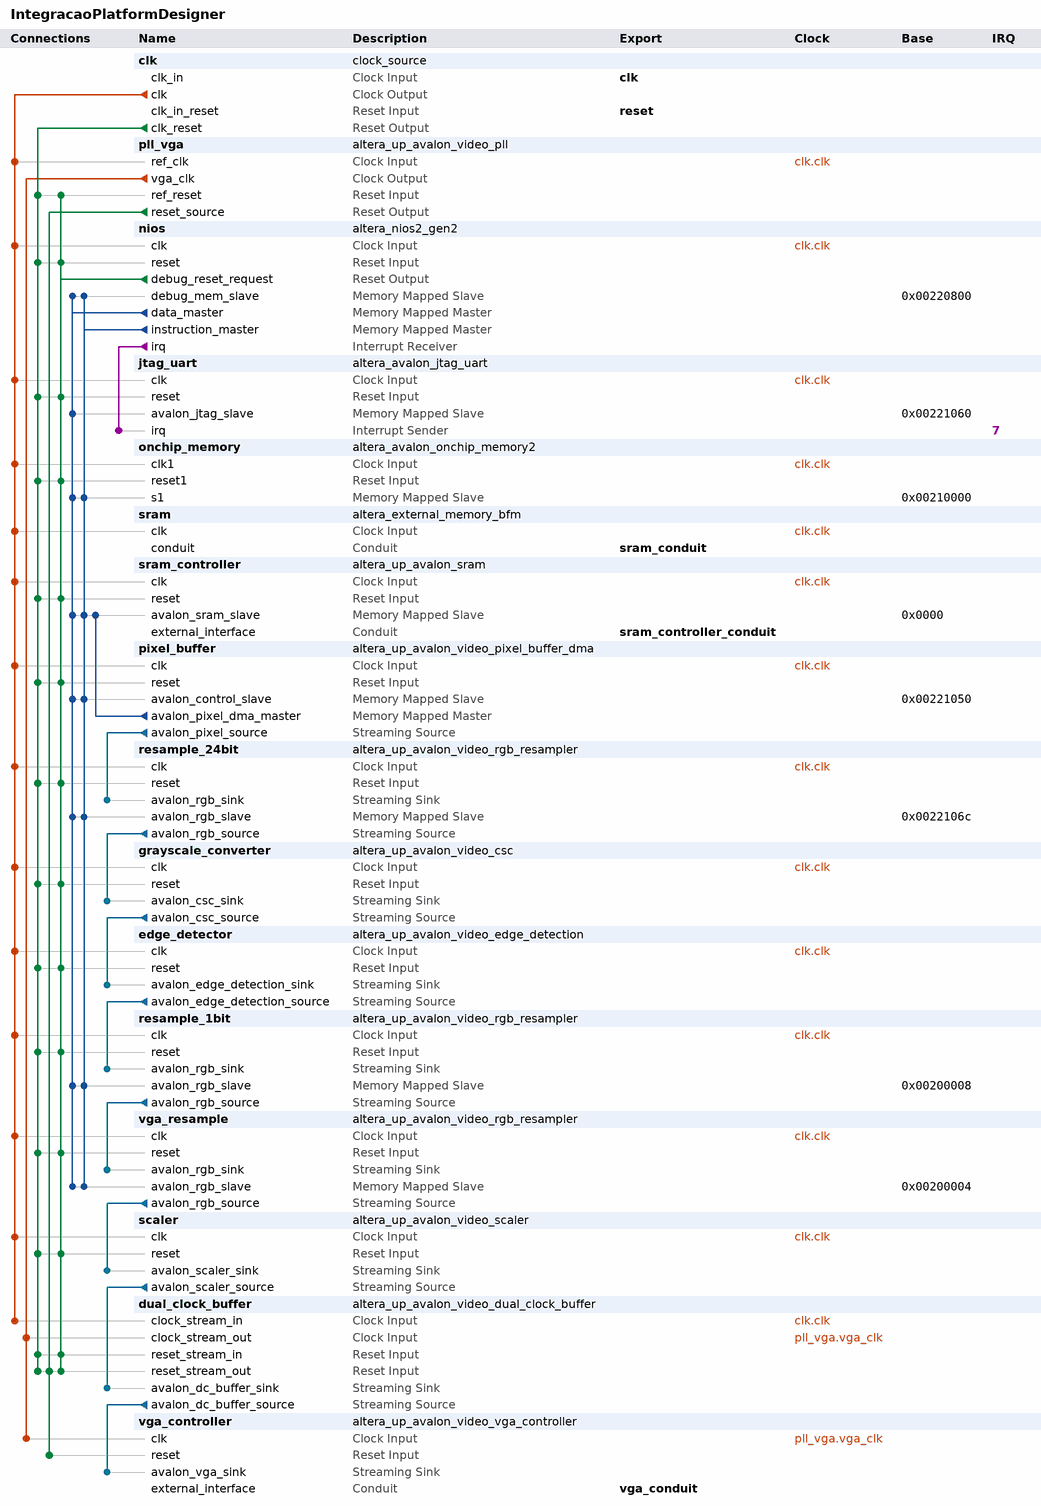
[diagram p0: system contents]
# Platform Designer (Qsys) system IntegracaoPlatformDesigner, Cyclone IV E EP4CE115F29C7
# Parameters at their usual value, and those the tool derives, are not listed.
package require -exact qsys 18.0
create_system IntegracaoPlatformDesigner
set_project_property DEVICE_FAMILY {Cyclone IV E}
set_project_property DEVICE EP4CE115F29C7

add_instance clk clock_source 20.1
set_instance_parameter_value clk clockFrequency 50000000

add_instance pll_vga altera_up_avalon_video_pll 18.0
set_instance_parameter_value pll_vga camera {5MP Digital Camera (THDB_D5M)}
set_instance_parameter_value pll_vga gui_refclk 50.0
set_instance_parameter_value pll_vga lcd {7" LCD on VEEK-MT and MTL/MTL2 Modules}

add_instance nios altera_nios2_gen2 20.1
set_instance_parameter_value nios dcache_size 2048
set_instance_parameter_value nios exceptionSlave onchip_memory.s1
set_instance_parameter_value nios icache_size 4096
set_instance_parameter_value nios impl Tiny
set_instance_parameter_value nios resetSlave onchip_memory.s1

add_instance jtag_uart altera_avalon_jtag_uart 20.1
set_instance_parameter_value jtag_uart simInteractiveOptions NO_INTERACTIVE_WINDOWS
set_instance_parameter_value jtag_uart useRegistersForReadBuffer true
set_instance_parameter_value jtag_uart useRegistersForWriteBuffer true

add_instance onchip_memory altera_avalon_onchip_memory2 20.1
set_instance_parameter_value onchip_memory dataWidth 16
set_instance_parameter_value onchip_memory dualPort false
set_instance_parameter_value onchip_memory initMemContent true
set_instance_parameter_value onchip_memory initializationFileName onchip_mem.hex
set_instance_parameter_value onchip_memory memorySize 65536
set_instance_parameter_value onchip_memory singleClockOperation true

add_instance sram altera_external_memory_bfm 20.1
set_instance_parameter_value sram ACTIVE_LOW_BEGINTRANSFER 0
set_instance_parameter_value sram ACTIVE_LOW_BYTEENABLE 1
set_instance_parameter_value sram ACTIVE_LOW_CHIPSELECT 1
set_instance_parameter_value sram ACTIVE_LOW_OUTPUTENABLE 1
set_instance_parameter_value sram ACTIVE_LOW_READ 0
set_instance_parameter_value sram ACTIVE_LOW_RESET 0
set_instance_parameter_value sram ACTIVE_LOW_WRITE 1
set_instance_parameter_value sram CDT_ADDRESS_W 20
set_instance_parameter_value sram CDT_NUMSYMBOLS 2
set_instance_parameter_value sram CDT_READ_LATENCY 2
set_instance_parameter_value sram CDT_SYMBOL_W 8
set_instance_parameter_value sram INIT_FILE altera_external_memory_bfm.hex
set_instance_parameter_value sram SIGNAL_ADDRESS_ROLES cdt_address
set_instance_parameter_value sram SIGNAL_BEGINTRANSFER_ROLES cdt_begintransfer
set_instance_parameter_value sram SIGNAL_BYTEENABLE_ROLES cdt_byteenable
set_instance_parameter_value sram SIGNAL_CHIPSELECT_ROLES cdt_chipselect
set_instance_parameter_value sram SIGNAL_DATA_ROLES cdt_data_io
set_instance_parameter_value sram SIGNAL_OUTPUTENABLE_ROLES cdt_outputenable
set_instance_parameter_value sram SIGNAL_READ_ROLES cdt_read
set_instance_parameter_value sram SIGNAL_RESET_ROLES cdt_reset
set_instance_parameter_value sram SIGNAL_WRITE_ROLES cdt_write
set_instance_parameter_value sram USE_BEGINTRANSFER 0
set_instance_parameter_value sram USE_BYTEENABLE 1
set_instance_parameter_value sram USE_CHIPSELECT 1
set_instance_parameter_value sram USE_OUTPUTENABLE 1
set_instance_parameter_value sram USE_READ 0
set_instance_parameter_value sram USE_RESET 0
set_instance_parameter_value sram USE_WRITE 1
set_instance_parameter_value sram VHDL_ID 0

add_instance sram_controller altera_up_avalon_sram 18.0
set_instance_parameter_value sram_controller board DE2-115
set_instance_parameter_value sram_controller pixel_buffer true

add_instance pixel_buffer altera_up_avalon_video_pixel_buffer_dma 18.0
set_instance_parameter_value pixel_buffer addr_mode Consecutive
set_instance_parameter_value pixel_buffer back_start_address 0
set_instance_parameter_value pixel_buffer color_space {16-bit RGB}
set_instance_parameter_value pixel_buffer image_height 480
set_instance_parameter_value pixel_buffer image_width 1280
set_instance_parameter_value pixel_buffer start_address 0

add_instance resample_24bit altera_up_avalon_video_rgb_resampler 18.0
set_instance_parameter_value resample_24bit alpha 1023
set_instance_parameter_value resample_24bit input_type {16-bit RGB}
set_instance_parameter_value resample_24bit output_type {24-bit RGB}

add_instance grayscale_converter altera_up_avalon_video_csc 18.0
set_instance_parameter_value grayscale_converter csc_type {24-bit RGB to Grayscale (Y)}

add_instance edge_detector altera_up_avalon_video_edge_detection 18.0
set_instance_parameter_value edge_detector intensity 2
set_instance_parameter_value edge_detector width 1280

add_instance resample_1bit altera_up_avalon_video_rgb_resampler 18.0
set_instance_parameter_value resample_1bit alpha 1023
set_instance_parameter_value resample_1bit input_type {8-bit Grayscale}
set_instance_parameter_value resample_1bit output_type {1-bit Black/White}

add_instance vga_resample altera_up_avalon_video_rgb_resampler 18.0
set_instance_parameter_value vga_resample alpha 1023
set_instance_parameter_value vga_resample input_type {1-bit Black/White}
set_instance_parameter_value vga_resample output_type {30-bit RGB}

add_instance scaler altera_up_avalon_video_scaler 18.0
set_instance_parameter_value scaler color_bits 10
set_instance_parameter_value scaler color_planes 3
set_instance_parameter_value scaler height_in 480
set_instance_parameter_value scaler height_scaling 1
set_instance_parameter_value scaler width_in 640
set_instance_parameter_value scaler width_scaling 0.5

add_instance dual_clock_buffer altera_up_avalon_video_dual_clock_buffer 18.0
set_instance_parameter_value dual_clock_buffer color_bits 10

add_instance vga_controller altera_up_avalon_video_vga_controller 18.0
set_instance_parameter_value vga_controller board DE2-115
set_instance_parameter_value vga_controller resolution {VGA 640x480}

# connections
add_connection clk.clk dual_clock_buffer.clock_stream_in clock
add_connection clk.clk edge_detector.clk clock
add_connection clk.clk grayscale_converter.clk clock
add_connection clk.clk jtag_uart.clk clock
add_connection clk.clk nios.clk clock
add_connection clk.clk onchip_memory.clk1 clock
add_connection clk.clk pixel_buffer.clk clock
add_connection clk.clk pll_vga.ref_clk clock
add_connection clk.clk resample_1bit.clk clock
add_connection clk.clk resample_24bit.clk clock
add_connection clk.clk scaler.clk clock
add_connection clk.clk sram.clk clock
add_connection clk.clk sram_controller.clk clock
add_connection clk.clk vga_resample.clk clock
add_connection pll_vga.vga_clk dual_clock_buffer.clock_stream_out clock
add_connection pll_vga.vga_clk vga_controller.clk clock
add_connection clk.clk_reset dual_clock_buffer.reset_stream_in reset
add_connection clk.clk_reset dual_clock_buffer.reset_stream_out reset
add_connection clk.clk_reset edge_detector.reset reset
add_connection clk.clk_reset grayscale_converter.reset reset
add_connection clk.clk_reset jtag_uart.reset reset
add_connection clk.clk_reset nios.reset reset
add_connection clk.clk_reset onchip_memory.reset1 reset
add_connection clk.clk_reset pixel_buffer.reset reset
add_connection clk.clk_reset pll_vga.ref_reset reset
add_connection clk.clk_reset resample_1bit.reset reset
add_connection clk.clk_reset resample_24bit.reset reset
add_connection clk.clk_reset scaler.reset reset
add_connection clk.clk_reset sram_controller.reset reset
add_connection clk.clk_reset vga_resample.reset reset
add_connection nios.debug_reset_request dual_clock_buffer.reset_stream_in reset
add_connection nios.debug_reset_request dual_clock_buffer.reset_stream_out reset
add_connection nios.debug_reset_request edge_detector.reset reset
add_connection nios.debug_reset_request grayscale_converter.reset reset
add_connection nios.debug_reset_request jtag_uart.reset reset
add_connection nios.debug_reset_request nios.reset reset
add_connection nios.debug_reset_request onchip_memory.reset1 reset
add_connection nios.debug_reset_request pixel_buffer.reset reset
add_connection nios.debug_reset_request pll_vga.ref_reset reset
add_connection nios.debug_reset_request resample_1bit.reset reset
add_connection nios.debug_reset_request resample_24bit.reset reset
add_connection nios.debug_reset_request scaler.reset reset
add_connection nios.debug_reset_request sram_controller.reset reset
add_connection nios.debug_reset_request vga_resample.reset reset
add_connection pll_vga.reset_source dual_clock_buffer.reset_stream_out reset
add_connection pll_vga.reset_source vga_controller.reset reset
add_connection nios.data_master jtag_uart.avalon_jtag_slave avalon
set_connection_parameter_value nios.data_master/jtag_uart.avalon_jtag_slave baseAddress 0x00221060
add_connection nios.data_master nios.debug_mem_slave avalon
set_connection_parameter_value nios.data_master/nios.debug_mem_slave baseAddress 0x00220800
add_connection nios.data_master onchip_memory.s1 avalon
set_connection_parameter_value nios.data_master/onchip_memory.s1 baseAddress 0x00210000
add_connection nios.data_master pixel_buffer.avalon_control_slave avalon
set_connection_parameter_value nios.data_master/pixel_buffer.avalon_control_slave baseAddress 0x00221050
add_connection nios.data_master resample_1bit.avalon_rgb_slave avalon
set_connection_parameter_value nios.data_master/resample_1bit.avalon_rgb_slave baseAddress 0x00200008
add_connection nios.data_master resample_24bit.avalon_rgb_slave avalon
set_connection_parameter_value nios.data_master/resample_24bit.avalon_rgb_slave baseAddress 0x0022106c
add_connection nios.data_master sram_controller.avalon_sram_slave avalon
set_connection_parameter_value nios.data_master/sram_controller.avalon_sram_slave baseAddress 0x0000
add_connection nios.data_master vga_resample.avalon_rgb_slave avalon
set_connection_parameter_value nios.data_master/vga_resample.avalon_rgb_slave baseAddress 0x00200004
add_connection nios.instruction_master nios.debug_mem_slave avalon
set_connection_parameter_value nios.instruction_master/nios.debug_mem_slave baseAddress 0x00220800
add_connection nios.instruction_master onchip_memory.s1 avalon
set_connection_parameter_value nios.instruction_master/onchip_memory.s1 baseAddress 0x00210000
add_connection nios.instruction_master pixel_buffer.avalon_control_slave avalon
set_connection_parameter_value nios.instruction_master/pixel_buffer.avalon_control_slave baseAddress 0x00221050
add_connection nios.instruction_master resample_1bit.avalon_rgb_slave avalon
set_connection_parameter_value nios.instruction_master/resample_1bit.avalon_rgb_slave baseAddress 0x00200008
add_connection nios.instruction_master resample_24bit.avalon_rgb_slave avalon
set_connection_parameter_value nios.instruction_master/resample_24bit.avalon_rgb_slave baseAddress 0x0022106c
add_connection nios.instruction_master sram_controller.avalon_sram_slave avalon
set_connection_parameter_value nios.instruction_master/sram_controller.avalon_sram_slave baseAddress 0x0000
add_connection nios.instruction_master vga_resample.avalon_rgb_slave avalon
set_connection_parameter_value nios.instruction_master/vga_resample.avalon_rgb_slave baseAddress 0x00200004
add_connection pixel_buffer.avalon_pixel_dma_master sram_controller.avalon_sram_slave avalon
set_connection_parameter_value pixel_buffer.avalon_pixel_dma_master/sram_controller.avalon_sram_slave baseAddress 0x0000
add_connection dual_clock_buffer.avalon_dc_buffer_source vga_controller.avalon_vga_sink avalon_streaming
add_connection edge_detector.avalon_edge_detection_source resample_1bit.avalon_rgb_sink avalon_streaming
add_connection grayscale_converter.avalon_csc_source edge_detector.avalon_edge_detection_sink avalon_streaming
add_connection pixel_buffer.avalon_pixel_source resample_24bit.avalon_rgb_sink avalon_streaming
add_connection resample_1bit.avalon_rgb_source vga_resample.avalon_rgb_sink avalon_streaming
add_connection resample_24bit.avalon_rgb_source grayscale_converter.avalon_csc_sink avalon_streaming
add_connection scaler.avalon_scaler_source dual_clock_buffer.avalon_dc_buffer_sink avalon_streaming
add_connection vga_resample.avalon_rgb_source scaler.avalon_scaler_sink avalon_streaming
add_connection nios.irq jtag_uart.irq interrupt
set_connection_parameter_value nios.irq/jtag_uart.irq irqNumber 7

# exported interfaces
add_interface clk clock sink
set_interface_property clk EXPORT_OF clk.clk_in
add_interface reset reset sink
set_interface_property reset EXPORT_OF clk.clk_in_reset
add_interface sram_conduit conduit end
set_interface_property sram_conduit EXPORT_OF sram.conduit
add_interface sram_controller_conduit conduit end
set_interface_property sram_controller_conduit EXPORT_OF sram_controller.external_interface
add_interface vga_conduit conduit end
set_interface_property vga_conduit EXPORT_OF vga_controller.external_interface

set_interconnect_requirement {$system} qsys_mm.clockCrossingAdapter HANDSHAKE
set_interconnect_requirement {$system} qsys_mm.enableEccProtection FALSE
set_interconnect_requirement {$system} qsys_mm.insertDefaultSlave FALSE
set_interconnect_requirement {$system} qsys_mm.maxAdditionalLatency 1

save_system IntegracaoPlatformDesigner.qsys
